# EAGLE schematic Sample Power Supply LM317 (EAGLE 8.4.1)
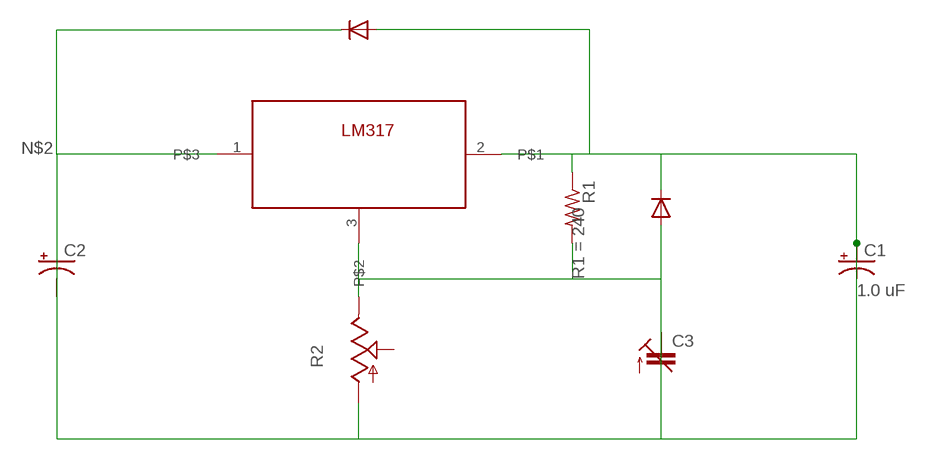
[diagram p0: schematic, sheet 1]

## Parts
C1  CPOL-USUD-4X5,8  [UD-4X5,8_NICHICON]
C2  CPOL-USUD-4X5,8  [UD-4X5,8_NICHICON]
C3  C-TRIMMTZBX4  [CTRIMTZBX4]
R1  R-US_R0805  [R0805]
R2  TRIM_US-3223G  [3223G]
U$1  LM317  [SOT223]

## Nets
N$2: C1.+ C1.- C2.+ C3.1(E) C3.2(A) R1.1 R1.2 R2.1(A) R2.3(E)
Unconnected: C2.- R2.2(S) U$1.1 U$1.2 U$1.3

## Library data of the parts
C1 = rcl:CPOL-US: POLARIZED CAPACITOR, American symbol; C0: 1.0 uF
C2 = rcl:CPOL-US: POLARIZED CAPACITOR, American symbol
C3 = rcl:C-TRIMM: Trimm capacitor
R1 = resistor:R-US_: RESISTOR, American symbol; R1: 240
R2 = pot:TRIM_US-: POTENTIOMETER
U$1 = LM317:LM317: Texas Instruments LM317 Linear Regulator - SOT223